# Altium schematic sheet TIDA-00830_MSP430F2617.SchDoc: DRV888xEVM Microcontroller Connections
size 431 x 279 mm; Date: Not shown in title block; ApprovedBy: Not shown in title block; CheckedBy: Not shown in title block; Author: Not shown in title block; CompanyName: Not shown in title block; DrawnBy: Rick Duncan; Engineer: Not shown in title block; Organization: Not shown in title block; Address1: Not shown in title block; Address2: Not shown in title block; Address3: Not shown in title block; Address4: Not shown in title block; DocumentNumber: 1; Revision: Use project parameter SCH_Rev; SheetNumber: 2; SheetTotal: 3; PageSetup: Record=PageOptions|CenterHorizontal=True|CenterVertical=True|PrintScale=1.00|XCorrection=1.00|YCorrection=1.00|PrintKind=0|BorderSize=5000000|LeftOffset=0|BottomOffset=0|Orientation=2|PaperLength=1000|PaperWidth=1000|Scale=100|PaperSource=15|PrintQuality=-3|MediaType=1|DitherType=10|PrintScaleMode=1|PaperKind=Letter|PaperIndex=1; CurrentTime: Not shown in title block; CurrentDate: Not shown in title block; Time: Not shown in title block; DocumentFullPathAndName: Not shown in title block; DocumentName: Not shown in title block; ModifiedDate: Not shown in title block; ImagePath: Not shown in title block
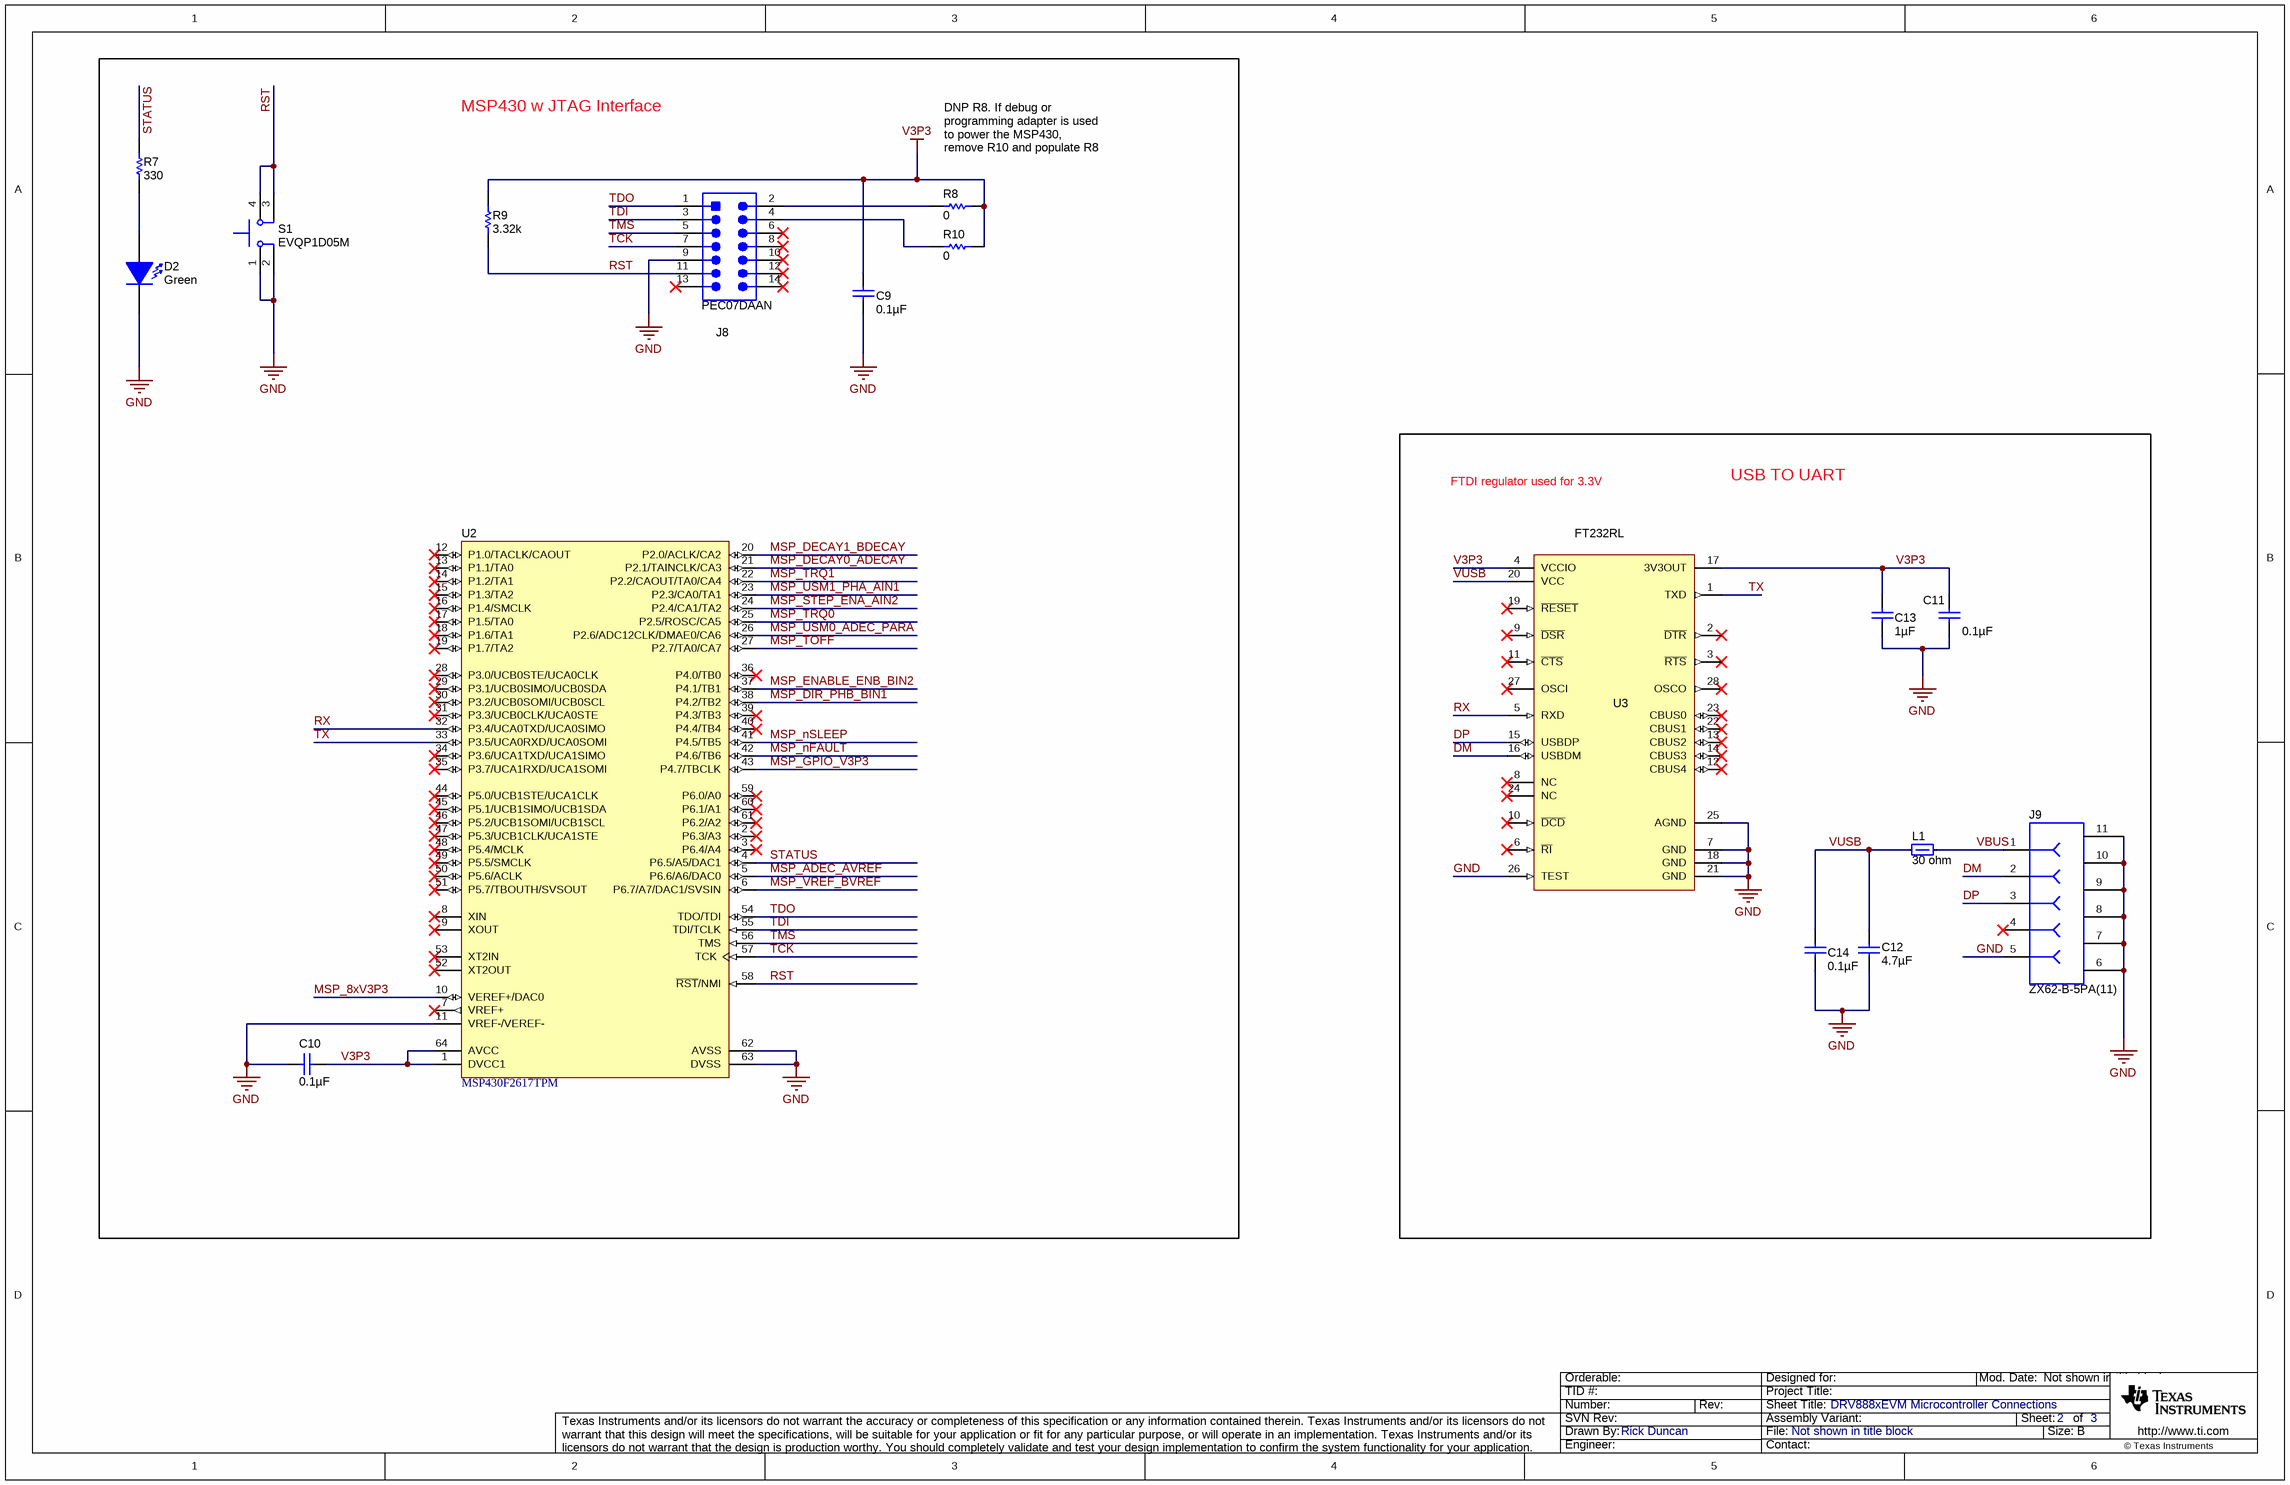
[diagram p0: TIDA-00830_MSP430F2617.SchDoc]

## Parts
C9  ValueDisplayed: 0.1µF  [0402L]  (hidden comment: GRM155R61A104KA01D)
C10  ValueDisplayed: 0.1µF  [0402L]  (hidden comment: GRM155R61A104KA01D)
C11  ValueDisplayed: 0.1µF  [0402L]  (hidden comment: GRM155R61A104KA01D)
C12  ValueDisplayed: 4.7µF  [0603L]  (hidden comment: CGB3B1X5R1A475K055AC)
C13  ValueDisplayed: 1µF  [0402L]  (hidden comment: GRM155R61A105KE15D)
C14  ValueDisplayed: 0.1µF  [0402L]  (hidden comment: GRM155R61A104KA01D)
D2  value Green  [LED_LTST-C190]  (hidden comment: LTST-C190GKT)
J8  PEC07DAAN  [CONN_PEC07DAAN]
J9  ZX62-B-5PA(11)  [CONN_USB_micro_ZX62-B-5PA]
L1  value 30 ohm  [0805L]  (hidden comment: MMZ2012R300A)
R7  value 330  [0402L]  (hidden comment: CRCW0402330RJNED)
R8  value 0  [0402L]  (hidden comment: ERJ-2GE0R00X)
R9  value 3.32k  [0402L]  (hidden comment: CRCW04023K32FKED)
R10  value 0  [0402L]  (hidden comment: ERJ-2GE0R00X)
S1  EVQP1D05M  [SW_EVQxxx05M]
U2  MSP430F2617TPM  [PM0064A_L]
U3  FT232RL  [SSOP28_M]

## Blocks framed on the sheet
MSP430 w JTAG Interface: C9 C10 D2 J8 R7-R10 S1 U2
USB TO UART: C11-C14 J9 L1 U3

## Nets
GND: C9.2 C10.2 C11.2 C12.2 C13.2 C14.2 D2.2(K) J8.9 J9.5 J9.6 J9.7 J9.8 J9.9 J9.10 J9.11 S1.1 S1.2 U2.11(VREF-/VEREF-) U2.62(AVSS) U2.63(DVSS) U3.7(GND) U3.18(GND) U3.21(GND) U3.25(AGND) U3.26(TEST)
V3P3: C9.1 C10.1 C11.1 C13.1 R8.1 R9.2 R10.1 U2.1(DVCC1) U2.64(AVCC) U3.4(VCCIO) U3.17(3V3OUT)
DM: J9.2 U3.16(USBDM)
DP: J9.3 U3.15(USBDP)
MSP_8xV3P3: U2.10(VEREF+/DAC0)
MSP_ADEC_AVREF: U2.5(P6.6/A6/DAC0)
MSP_DECAY0_ADECAY: U2.21(P2.1/TAINCLK/CA3)
MSP_DECAY1_BDECAY: U2.20(P2.0/ACLK/CA2)
MSP_DIR_PHB_BIN1: U2.38(P4.2/TB2)
MSP_ENABLE_ENB_BIN2: U2.37(P4.1/TB1)
MSP_GPIO_V3P3: U2.43(P4.7/TBCLK)
MSP_nFAULT: U2.42(P4.6/TB6)
MSP_nSLEEP: U2.41(P4.5/TB5)
MSP_STEP_ENA_AIN2: U2.24(P2.4/CA1/TA2)
MSP_TOFF: U2.27(P2.7/TA0/CA7)
MSP_TRQ0: U2.25(P2.5/ROSC/CA5)
MSP_TRQ1: U2.22(P2.2/CAOUT/TA0/CA4)
MSP_USM0_ADEC_PARA: U2.26(P2.6/ADC12CLK/DMAE0/CA6)
MSP_USM1_PHA_AIN1: U2.23(P2.3/CA0/TA1)
MSP_VREF_BVREF: U2.6(P6.7/A7/DAC1/SVSIN)
RST: J8.11 R9.1 S1.3 S1.4 U2.58(~{RST}/NMI)
RX: U2.32(P3.4/UCA0TXD/UCA0SIMO) U3.5(RXD)
STATUS: R7.2 U2.4(P6.5/A5/DAC1)
TCK: J8.7 U2.57(TCK)
TDI: J8.3 U2.55(TDI/TCLK)
TDO: J8.1 U2.54(TDO/TDI)
TMS: J8.5 U2.56(TMS)
TX: U2.33(P3.5/UCA0RXD/UCA0SOMI) U3.1(TXD)
VBUS: J9.1 L1.2
VUSB: C12.1 C14.1 L1.1 U3.20(VCC)
NetD2_1: D2.1(A) R7.1
NetJ8_2: J8.2 R8.2
NetJ8_4: J8.4 R10.2

Not connected (* = marked no-connect by the designer): J8 6* 8* 10* 12* 13* 14*; J9 4*; U2 2(P6.3/A3)* 3(P6.4/A4)* 7(VREF+)* 8(XIN)* 9(XOUT)* 12(P1.0/TACLK/CAOUT)* 13(P1.1/TA0)* 14(P1.2/TA1)* 15(P1.3/TA2)* 16(P1.4/SMCLK)* 17(P1.5/TA0)* 18(P1.6/TA1)* 19(P1.7/TA2)* 28(P3.0/UCB0STE/UCA0CLK)* 29(P3.1/UCB0SIMO/UCB0SDA)* 30(P3.2/UCB0SOMI/UCB0SCL)* 31(P3.3/UCB0CLK/UCA0STE)* 34(P3.6/UCA1TXD/UCA1SIMO)* 35(P3.7/UCA1RXD/UCA1SOMI)* 36(P4.0/TB0)* 39(P4.3/TB3)* 40(P4.4/TB4)* 44(P5.0/UCB1STE/UCA1CLK)* 45(P5.1/UCB1SIMO/UCB1SDA)* 46(P5.2/UCB1SOMI/UCB1SCL)* 47(P5.3/UCB1CLK/UCA1STE)* 48(P5.4/MCLK)* 49(P5.5/SMCLK)* 50(P5.6/ACLK)* 51(P5.7/TBOUTH/SVSOUT)* 52(XT2OUT)* 53(XT2IN)* 59(P6.0/A0)* 60(P6.1/A1)* 61(P6.2/A2)*; U3 2(~{DTR})* 3(~{RTS})* 6(~{RI})* 8(NC)* 9(~{DSR})* 10(~{DCD})* 11(~{CTS})* 12(CBUS4)* 13(CBUS2)* 14(CBUS3)* 19(~{RESET})* 22(CBUS1)* 23(CBUS0)* 24(NC)* 27(OSCI)* 28(OSCO)*

## Notes on the sheet
- (near R8) DNP R8. If debug or programming adapter is used to power the MSP430, remove R10 and populate R8
- FTDI regulator used for 3.3V
- Drawn By:
- SVN Rev:
- Number:
- TID #:
- Orderable:
- Rev:
- Sheet Title:
- File:
- Project Title:
- Designed for:
- Assembly Variant:
- Mod. Date:
- Sheet:
- Size:
- of
- B
- http://www.ti.com
- Texas Instruments and/or its licensors do not warrant the accuracy or completeness of this specification or any information contained therein. Texas Instruments and/or its licensors do not warrant that this design will meet the specifications, will be suitable for your application or fit for any particular purpose, or will operate in an implementation. Texas Instruments and/or its licensors do not warrant that the design is production worthy. You should completely validate and test your design implementation to confirm the system functionality for your application.
- Engineer:
- Contact:
- © Texas Instruments

## Library data of the parts
C9-C11 C14 = GRM155R61A104KA01D: CAP, CERM, 0.1 µF, 10 V, +/- 10%, X5R, 0402; Manufacturer: MuRata; Value: 0.1uF; Polarized: N; CompType: Capacitor; U/M: EA; Cap_F: 0.0000001; Tolerance_%: 10; Value1: Unknown; Value2: 10V; TaMin_C: -55; TaMax_C: 85; Cap_Case: 0402; SymbolVersion: 2008-07-09; PartNumber: GRM155R61A104KA01D; PackageReference: 0402; RoHS: Y; VDC_V: 10; MountType: SMT; Technology: Ceramic; TempCo: X5R; Published: 2008-06-19; Publisher: Texas Instruments; LatestRevisionDate: 2015-06-10; ComponentLink1Description: Datasheet link; ComponentLink1URL: http://search.murata.co.jp/Ceramy/PnsearchViewAction.do?HnOFG=ON&HnNFG=ON&SEL_CNT=50&sLang=en&sKey=GRM155R61A104KA01D&x=9&y=9&search=startwith; Supplier 1: Digi-Key; Supplier Part Number 1: 490-1318-1-ND; Supplier 2: Mouser; Supplier Part Number 2: 81-GRM155R61A104KA01; Supplier 3: Farnell; Supplier Part Number 3: 1828862
C12 = CGB3B1X5R1A475K055AC: CAP, CERM, 4.7 µF, 10 V, +/- 10%, X5R, 0603; Manufacturer: TDK; Polarized: N; CompType: Capacitor; Value: 4.7uF; U/M: EA; Cap_F: 0.0000047; Tolerance_%: 10; Value1: Unknown; Value2: 10V; TaMin_C: -55; TaMax_C: 85; Cap_Case: 0603; SymbolVersion: 2008-07-09; PartNumber: CGB3B1X5R1A475K055AC; PackageReference: 0603; RoHS: Y; VDC_V: 10; MountType: SMT; Technology: Ceramic; TempCo: X5R; Published: 2008-06-19; Publisher: Texas Instruments; LatestRevisionDate: 2015-06-10; ComponentLink1Description: Datasheet link; ComponentLink1URL: http://www.tdk.com/pdf/mlcc_product_guide_A12.pdf; Supplier 1: Digi-Key; Supplier Part Number 1: 445-7482-1-ND
C13 = GRM155R61A105KE15D: CAP, CERM, 1 µF, 10 V, +/- 10%, X5R, 0402; Manufacturer: MuRata; Value: 1uF; Polarized: N; CompType: Capacitor; U/M: EA; Cap_F: 0.000001; Tolerance_%: 10; Value1: Unknown; Value2: 10V; TaMin_C: -55; TaMax_C: 85; Cap_Case: 0402; SymbolVersion: 2008-07-09; PartNumber: GRM155R61A105KE15D; PackageReference: 0402; RoHS: Y; VDC_V: 10; MountType: SMT; Technology: Ceramic; TempCo: X5R; Published: 2008-06-19; Publisher: Texas Instruments; LatestRevisionDate: 2015-06-10; ComponentLink1Description: Datasheet link; ComponentLink1URL: http://search.murata.co.jp/Ceramy/PnsearchViewAction.do?HnOFG=ON&HnNFG=ON&SEL_CNT=50&sLang=en&sKey=GRM155R61A105KE15D&x=9&y=9&search=startwith; Supplier 1: Digi-Key; Supplier Part Number 1: 490-3890-1-ND; Supplier 2: Mouser; Supplier Part Number 2: 81-GRM155R61A105KE15; Supplier 3: Farnell; Supplier Part Number 3: 1735523
D2 = LTST-C190GKT: LED, Green, SMD; Manufacturer: Lite-On; Vf_V: 2.1; Value2: 2.1V; Io_A: 0.02; Power_TotalModule: 0.1; Value1: 0.1W; U/M: EA; PartNumber: LTST-C190GKT; SymbolVersion: 2008-12-08; PackageReference: 1.6x0.8x0.8mm; ComponentLink1URL: https://sps06.itg.ti.com/sites/KMS/crossdivteams/altium/docs/ComponentDatasheets/LTST-C190GKT.pdf; ComponentLink1Description: Datasheet link; Supplier 1: Digi-Key; Supplier Part Number 1: 160-1183-1-ND; MountType: SMT; CompType: LED; RoHS: Y; Type: ?; Color: green; Published: 2008-07-11; Publisher: Texas Instruments; LatestRevisionDate: 2015-06-04; Supplier 2: Mouser; Supplier Part Number 2: 859-LTST-C190GKT
J8 = PEC07DAAN: Header, 100mil, 7x2, Tin, TH; Manufacturer: Sullins Connector Solutions; SymbolCreator: a0412235; U/M: EA; SymbolVersion: 2013-12-22; PartNumber: PEC07DAAN; PackageReference: Header, 7x2, 100mil, Tin; CompType: Header; RoHS: Y; MountType: TH; ComponentLink1Description: Datasheet Link; ComponentLink1URL: http://www.sullinscorp.com/catalogs/97_Page78-79_HEADER_.100_2.54mm_MALE_BREAKAWAY.pdf; Publisher: Texas Instruments; LatestRevisionDate: 2015-06-02; Supplier 1: Digi-Key; Supplier Part Number 1: S2012E-07-ND; ClassName: Header
J9 = ZX62-B-5PA(11): Connector, Receptacle, Micro-USB Type B, R/A, Bottom Mount SMT; Manufacturer: Hirose Electric Co. Ltd.; SymbolCreator: a0411947; U/M: EA; SymbolVersion: 2013-04-05; PartNumber: ZX62-B-5PA(11); PackageReference: Micro USB-B receptacle; CompType: Receptacle; RoHS: Y; MountType: SMT; ComponentLink1Description: Datasheet Link; ComponentLink1URL: http://www.hirose.co.jp/cataloge_hp/e24200011.pdf; Publisher: Texas Instruments; LatestRevisionDate: 2015-06-10; Supplier 1: Digi-Key; Supplier Part Number 1: H11634CT-ND; Supplier 2: Mouser; Supplier Part Number 2: 798-ZX62-B-5PA11; Supplier 3: Farnell; Supplier Part Number 3: 1645325
L1 = MMZ2012R300A: Ferrite Bead, 30 ohm @ 100 MHz, 1.5 A, 0805; Manufacturer: TDK; Imax_A: 1.5; DCR_ohm: 0.05; Value1: 0.05 ohm; Value2: 1.5A; ZTyp@100MHz_Ohm: 30; ComponentLink1URL: http://www.tdk.co.jp/tefe02/e9412_mmz.pdf; PackageReference: 0805; SymbolVersion: 2009-06-02; PartNumber: MMZ2012R300A; ComponentLink1Description: Datasheet link; Supplier 1: Digi-Key; Supplier Part Number 1: 445-2199-1-ND; MountType: SMT; CompType: Ferrite Bead; Published: 2014-04-30; Publisher: Texas Instruments; LatestRevisionDate: 2015-06-08; RoHS: Y; Supplier 2: Mouser; Supplier Part Number 2: 810-MMZ2012R300A; Supplier 3: Farnell; Supplier Part Number 3: 1669723
R7 = CRCW0402330RJNED: RES, 330, 5%, 0.063 W, 0402; Manufacturer: Vishay-Dale; CompType: Resistor; Value_Code: 330R; Tolerance_%: 5; Power_W: 0.063; Value2: 0.063W; VDC_V: 50; TempCo: 200 ppm/C; EIA_Code: E24; U/M: EA; SymbolVersion: 2009-05-29; PartNumber: CRCW0402330RJNED; PackageReference: 0402; RoHS: Y; Res_ohm: 330; Value1: 5%; MountType: SMT; Technology: Thick Film; Published: 2008-06-26; Publisher: Texas Instruments; LatestRevisionDate: 2015-05-27; ComponentLink1Description: Datasheet link; ComponentLink1URL: http://www.vishay.com/docs/20035/dcrcwe3.pdf; Supplier 1: Digi-Key; Supplier Part Number 1: 541-330JCT-ND; Supplier 2: Mouser; Supplier Part Number 2: 71-CRCW0402J-330-E3; Supplier 3: Farnell; Supplier Part Number 3: 1514698; ValueDisplayed: 330
R8 R10 = ERJ-2GE0R00X: RES, 0, 5%, 0.063 W, 0402; Manufacturer: Panasonic; CompType: Resistor; Value_Code: 0000; Tolerance_%: 5; Power_W: 0.063; Value2: 0.063W; VDC_V: 50; TempCo: 600 ppm/C; EIA_Code: E24; U/M: EA; SymbolVersion: 2009-05-29; PartNumber: ERJ-2GE0R00X; PackageReference: 0402; RoHS: Y; Res_ohm: 0; Value1: 5%; MountType: SMT; Technology: Thick Film; Published: 2008-06-26; Publisher: Texas Instruments; LatestRevisionDate: 2015-05-27; ComponentLink1Description: Datasheet link; ComponentLink1URL: http://www.panasonic.com/industrial/components/pdf/AOA0000CE1.pdf; Supplier 1: Digi-Key; Supplier Part Number 1: P0.0JCT-ND; Supplier 2: Mouser; Supplier Part Number 2: 667-ERJ-2GE0R00X; Supplier 3: Farnell; Supplier Part Number 3: 2059190; ValueDisplayed: 0
R9 = CRCW04023K32FKED: RES, 3.32 k, 1%, 0.063 W, 0402; Manufacturer: Vishay-Dale; CompType: Resistor; Res_ohm: 3320; Value_Code: 3k32; Tolerance_%: 1; Power_W: 0.063; Value2: 0.063W; VDC_V: 50; TempCo: 100 ppm/C; EIA_Code: E96; U/M: EA; SymbolVersion: 2009-05-29; PartNumber: CRCW04023K32FKED; PackageReference: 0402; RoHS: Y; Value1: 1%; MountType: SMT; Technology: Thick Film; Published: 2008-06-26; Publisher: Texas Instruments; LatestRevisionDate: 2015-05-27; ComponentLink1Description: Datasheet link; ComponentLink1URL: http://www.vishay.com/docs/20035/dcrcwe3.pdf; Supplier 1: Digi-Key; Supplier Part Number 1: 541-3.32KLCT-ND; Supplier 2: Mouser; Supplier Part Number 2: 71-CRCW0402-3.32K-E3; Supplier 3: Farnell; Supplier Part Number 3: 1652792; ValueDisplayed: 3.32k
S1 = EVQP1D05M: Switch, Tactile, SPST-NO, 0.05A, 12V, SMT; Manufacturer: Panasonic; SymbolCreator: a0799628; VDC_V: 12; SwitchFunction: Off-Mom; PositionCount: 1; CurrentRating_mA: 50; SymbolVersion: 2013-10-28; PartNumber: EVQP1D05M; MountType: SMT; ComponentLink1Description: Datasheet URL; ComponentLink1URL: http://industrial.panasonic.com/www-data/pdf/ATK0000/ATK0000CE16.pdf; RoHS: Y; Circuit: SPST-NO; Orientation: Top Actuated; CompType: Switch; PackageReference: 6x5x6 mm; Publisher: Texas Instruments; LatestRevisionDate: 2015-06-10; Supplier 1: Digi-Key; Supplier Part Number 1: P10888SCT-ND; Supplier 2: Mouser; Supplier Part Number 2: 667-EVQ-P1D05M; Supplier 3: Farnell; Supplier Part Number 3: 2079569
U2 = MSP430F2617TPM: 16 MHz Mixed Signal Microcontroller with 92 KB Flash, 8192 B SRAM and 48 GPIOs, -40 to 105 degC, 64-pin QFP (PM), Green (RoHS & no Sb/Br); Manufacturer: Texas Instruments; Alternate PartNumber: Equivalent; ADC: 12-bit SAR; ADC Channels: 8; Brown Out Reset: Yes; DMA: 3; Flash(KB): 92; Frequency(MHz): 16; GPIO: 48; Multiplier: 16x16; Pin/Package: 64LQFP; SRAM(B): 8192; SubFamily: 2 Series, Extended Temp; Timers - 16-bit: 2; ComponentLink1URL: http://www.ti.com/; PackageReference: PM0064A; PartNumber: MSP430F2617TPM; Alternate Manufacturer: Texas Instruments; ComponentLink1Description: Manufacturer URL; MountType: SMT; DatasheetVersion: SLAS541K; PackageVersion: 0; PackageDescription: 64-Pin Plastic Flat Pack, Body 10 x 10 mm, Pitch 0.5 mm; Comparators: Yes; Eco-Plan: Green (RoHS & no Sb/Br); SVS: Yes; Temp Sensor: Yes; USCI_A (UART/LIN/IrDA/SPI): 2; USCI_B (I2C & SPI): 2; Watchdog: Yes; Code_JEDEC: MS-026; ComponentLink2Description: Datasheet; ComponentLink2URL: http://www.ti.com/general/docs/lit/getliterature.tsp?genericPartNumber=MSP430F2617&fileType=pdf
U3 = FT232RL: USB to Serial UART, SSOP28; Manufacturer: FTDI; SymbolCreator: x0208326; ComponentLink1URL: http://www.ftdichip.com/Support/Documents/DataSheets/ICs/DS_FT232R.pdf; PackageReference: SSOP28; PartNumber: FT232RL; SymbolVersion: 2014-03-03; ComponentLink1Description: Datasheet Link; Supplier 1: Digi-Key; Supplier Part Number 1: 768-1007-1-ND; MountType: SMT; RoHS: Y; Publisher: Texas Instruments; LatestRevisionDate: 2015-06-10; Supplier 2: Mouser; Supplier Part Number 2: 895-FT232RL; Supplier 3: Farnell; Supplier Part Number 3: 1146032